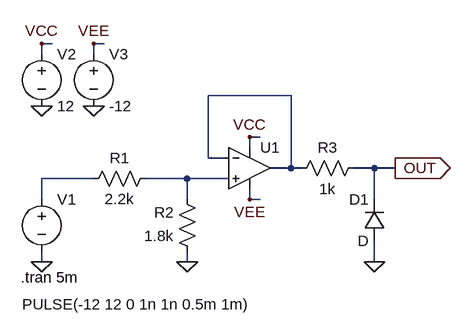
[diagram p0: schematic Sub_Osc_In_Buff.asc]
Sub_Osc_In_Buff.asc, the LTspice schematic file:
Version 4
SHEET 1 880 680
WIRE 144 -112 128 -112
WIRE 224 -112 208 -112
WIRE 128 -96 128 -112
WIRE 208 -96 208 -112
WIRE 512 -32 384 -32
WIRE 464 32 448 32
WIRE 448 48 448 32
WIRE 384 64 384 -32
WIRE 416 64 384 64
WIRE 512 80 512 -32
WIRE 512 80 480 80
WIRE 528 80 512 80
WIRE 640 80 608 80
WIRE 672 80 640 80
WIRE 208 96 128 96
WIRE 352 96 288 96
WIRE 416 96 352 96
WIRE 128 128 128 96
WIRE 352 128 352 96
WIRE 448 128 448 112
WIRE 464 128 448 128
WIRE 640 128 640 80
WIRE 128 224 128 208
WIRE 352 224 352 208
WIRE 640 224 640 192
FLAG 128 224 0
FLAG 352 224 0
FLAG 640 224 0
FLAG 448 32 VCC
FLAG 448 128 VEE
FLAG 128 -16 0
FLAG 208 -16 0
FLAG 128 -112 VCC
FLAG 208 -112 VEE
FLAG 672 80 OUT
IOPIN 672 80 Out
SYMBOL voltage 128 112 R0
WINDOW 3 -30 178 Left 2
WINDOW 123 0 0 Left 0
WINDOW 39 0 0 Left 0
SYMATTR Value PULSE(-12 12 0 1n 1n 0.5m 1m)
SYMATTR InstName V1
SYMBOL res 304 80 R90
WINDOW 0 0 56 VBottom 2
WINDOW 3 32 56 VTop 2
SYMATTR InstName R1
SYMATTR Value 2.2k
SYMBOL res 368 224 R180
WINDOW 0 36 76 Left 2
WINDOW 3 36 40 Left 2
SYMATTR InstName R2
SYMATTR Value 1.8k
SYMBOL diode 656 192 R180
WINDOW 0 24 64 Left 2
WINDOW 3 24 0 Left 2
SYMATTR InstName D1
SYMBOL Opamps\\UniversalOpamp2 448 80 R0
SYMATTR InstName U1
SYMBOL voltage 128 -112 R0
WINDOW 123 0 0 Left 0
WINDOW 39 0 0 Left 0
SYMATTR InstName V2
SYMATTR Value 12
SYMBOL voltage 208 -112 R0
WINDOW 123 0 0 Left 0
WINDOW 39 0 0 Left 0
SYMATTR InstName V3
SYMATTR Value -12
SYMBOL res 624 64 R90
WINDOW 0 0 56 VBottom 2
WINDOW 3 32 56 VTop 2
SYMATTR InstName R3
SYMATTR Value 1k
TEXT 96 248 Left 2 !.tran 5m

The netlist it stands for:
* Sub_Osc_In_Buff.asc
V1 N002 0 PULSE(-12 12 0 1n 1n 0.5m 1m)
R1 N003 N002 2.2k
R2 0 N003 1.8k
D1 0 OUT D
XU1 N003 N001 VCC VEE N001 level.2 Avol=1Meg GBW=10Meg Slew=10Meg ilimit=25m rail=0 Vos=0 phimargin=45 en=0 enk=0 in=0 ink=0 Rin=500Meg  ; pins IN+ IN- V+ V- OUT
V2 VCC 0 12
V3 VEE 0 -12
R3 OUT N001 1k
.model D D
.lib standard.dio
.tran 5m
.lib UniversalOpamps2.sub
.backanno
.end